# EAGLE schematic central (EAGLE 9.2.1)
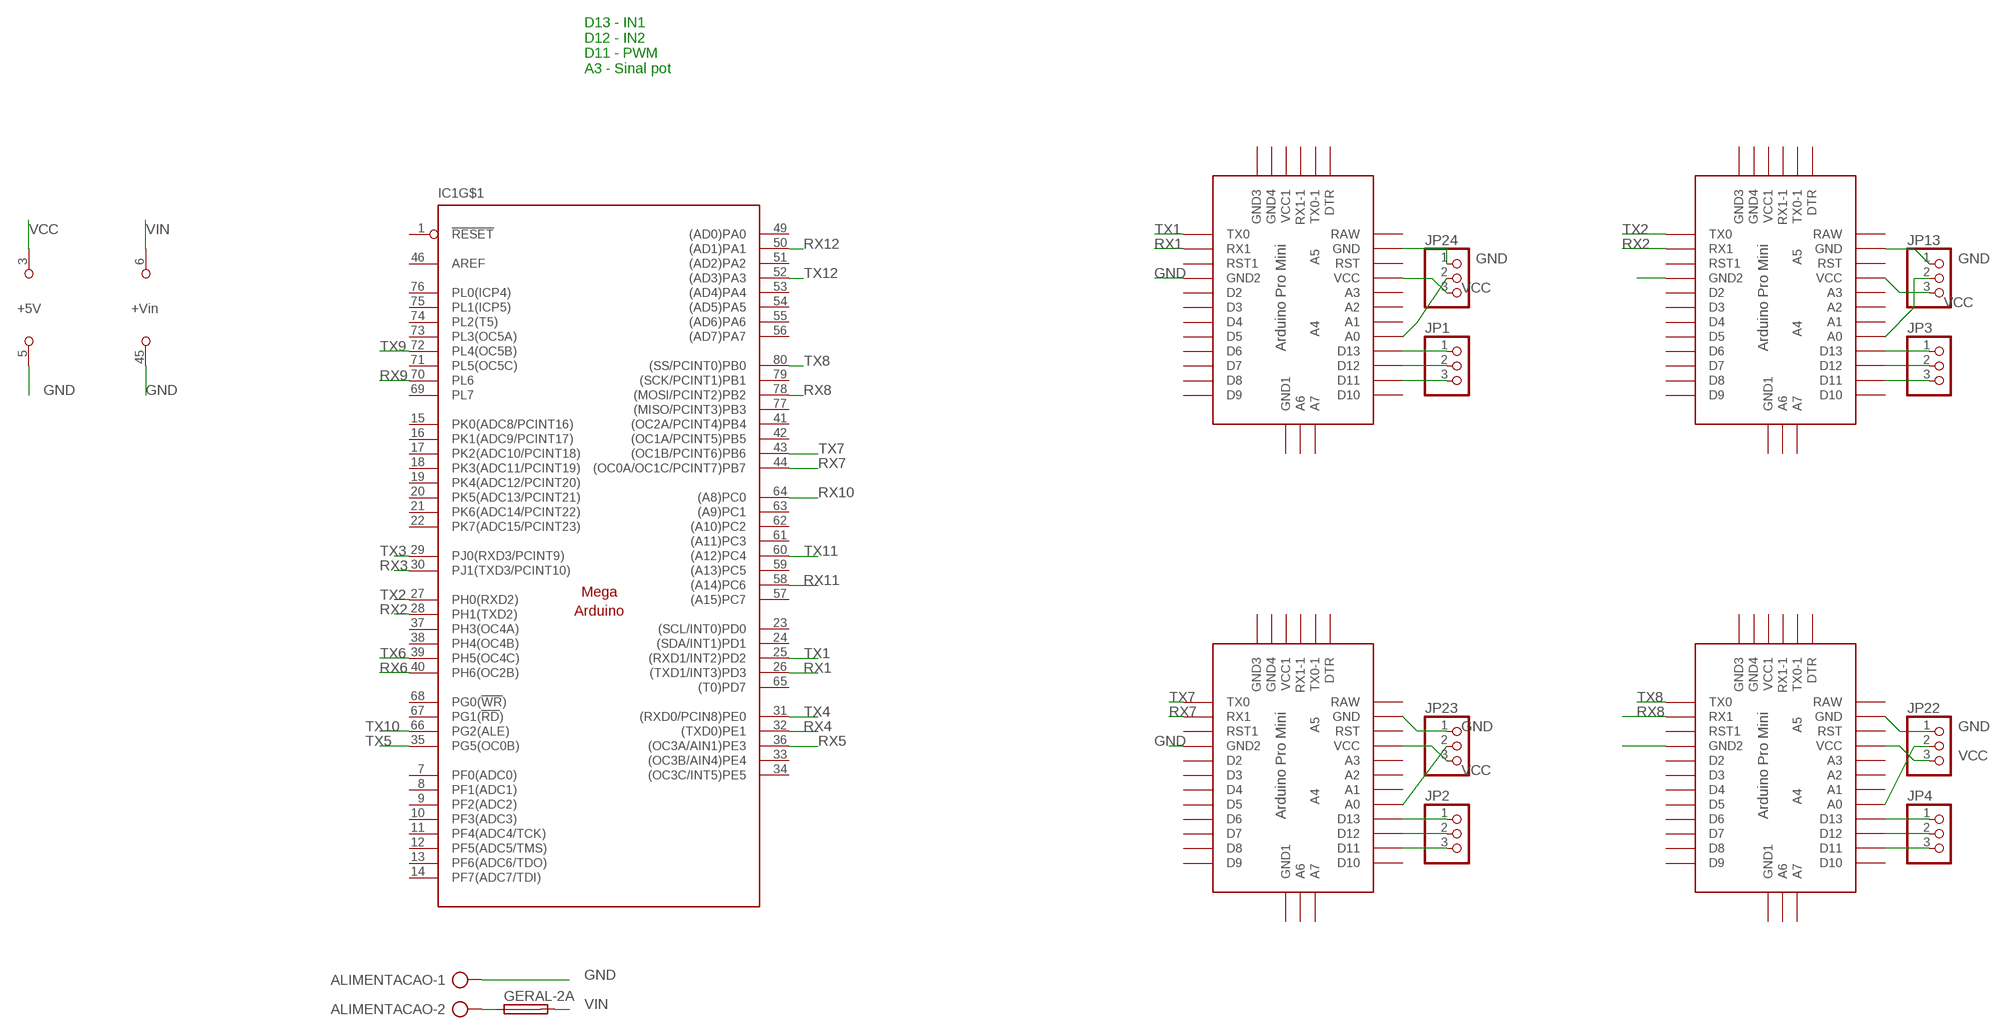
[diagram p0: schematic, sheet 1, part 1 of 2]
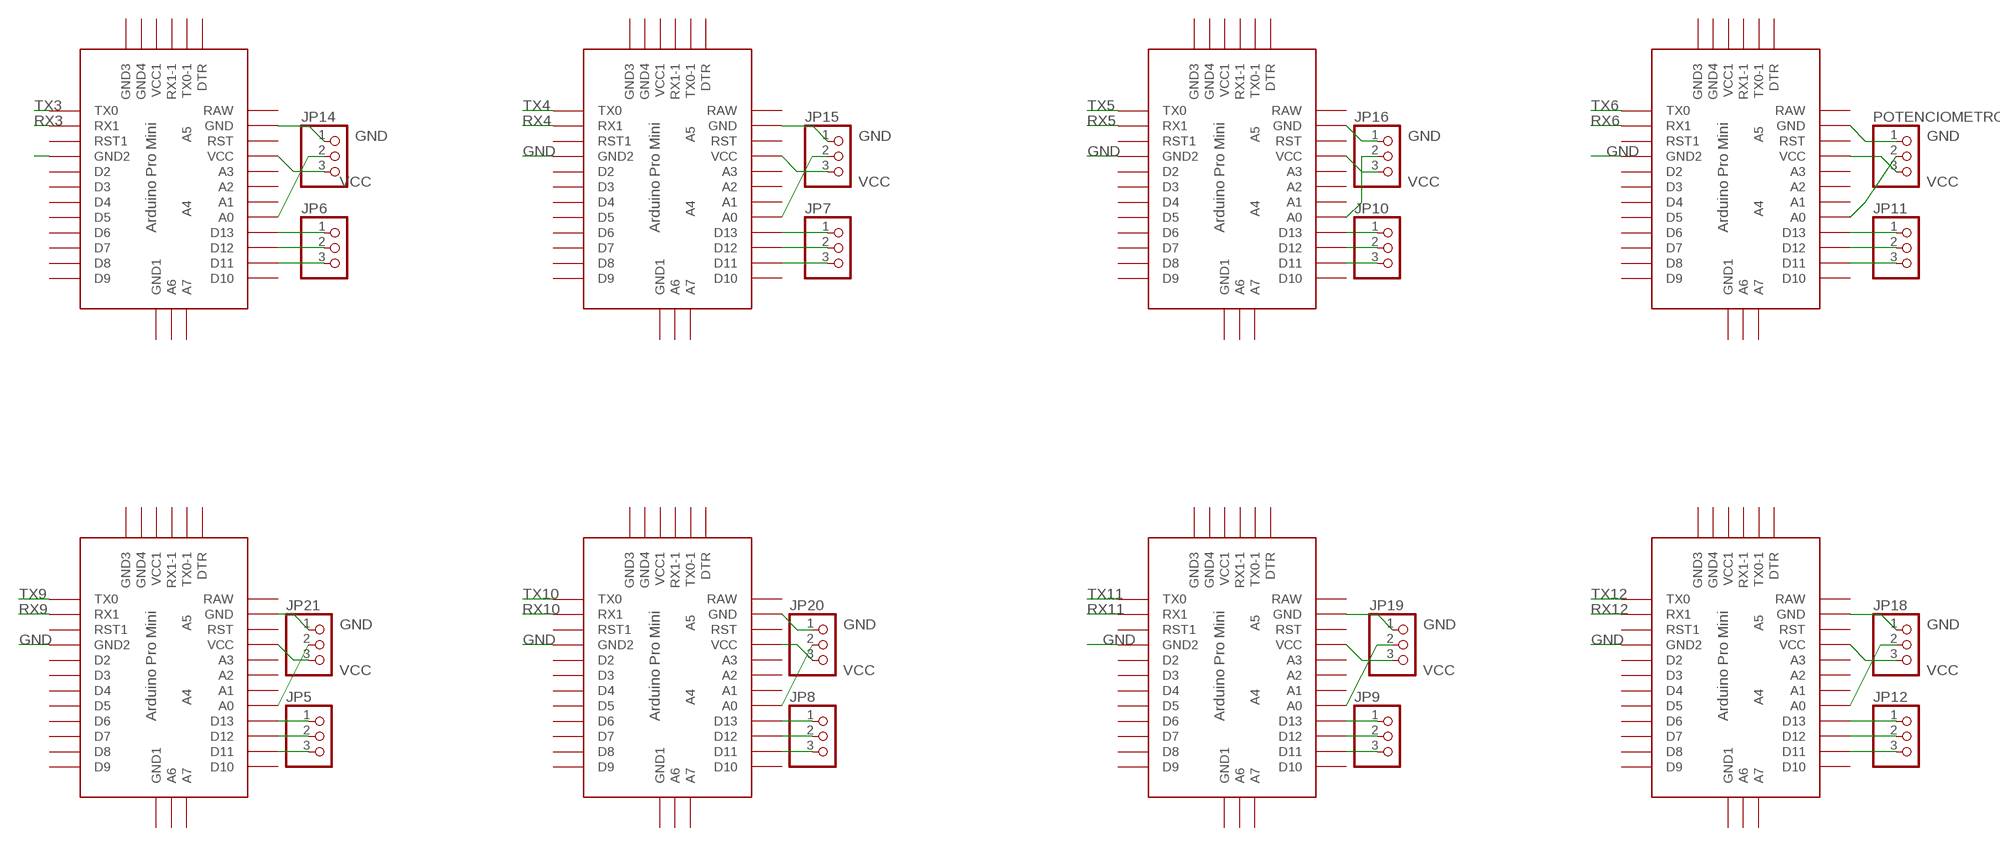
[diagram p1: schematic, sheet 1, part 2 of 2]

## Parts
ALIMENTACAO  AK500/2  [AK500/2]
GERAL-2A  SH22,5A  [SH22,5A]
IC1  MEGAARDUINO_22  [MEGA_ARDUINO_2]
JP1  PINHD-1X3  [1X03]
JP2  PINHD-1X3  [1X03]
JP3  PINHD-1X3  [1X03]
JP4  PINHD-1X3  [1X03]
JP5  PINHD-1X3  [1X03]
JP6  PINHD-1X3  [1X03]
JP7  PINHD-1X3  [1X03]
JP8  PINHD-1X3  [1X03]
JP9  PINHD-1X3  [1X03]
JP10  PINHD-1X3  [1X03]
JP11  PINHD-1X3  [1X03]
JP12  PINHD-1X3  [1X03]
JP13  PINHD-1X3  [1X03]
JP14  PINHD-1X3  [1X03]
JP15  PINHD-1X3  [1X03]
JP16  PINHD-1X3  [1X03]
JP18  PINHD-1X3  [1X03]
JP19  PINHD-1X3  [1X03]
JP20  PINHD-1X3  [1X03]
JP21  PINHD-1X3  [1X03]
JP22  PINHD-1X3  [1X03]
JP23  PINHD-1X3  [1X03]
JP24  PINHD-1X3  [1X03]
POTENCIOMETRO  PINHD-1X3  [1X03]
U$1  ABK-PRO-MINI  [ABK-PRO-MINI]
U$2  ABK-PRO-MINI  [ABK-PRO-MINI]
U$3  ABK-PRO-MINI  [ABK-PRO-MINI]
U$4  ABK-PRO-MINI  [ABK-PRO-MINI]
U$5  ABK-PRO-MINI  [ABK-PRO-MINI]
U$6  ABK-PRO-MINI  [ABK-PRO-MINI]
U$7  ABK-PRO-MINI  [ABK-PRO-MINI]
U$8  ABK-PRO-MINI  [ABK-PRO-MINI]
U$9  ABK-PRO-MINI  [ABK-PRO-MINI]
U$10  ABK-PRO-MINI  [ABK-PRO-MINI]
U$11  ABK-PRO-MINI  [ABK-PRO-MINI]
U$12  ABK-PRO-MINI  [ABK-PRO-MINI]

## Nets
GND: ALIMENTACAO.1 IC1.5(GND) IC1.45(GND) JP13.1 JP14.1 JP15.1 JP16.1 JP18.1 JP19.1 JP20.1 JP21.1 JP22.1 JP23.1 JP24.1 POTENCIOMETRO.1 U$1.GND U$1.GND1(GND2) U$2.GND U$2.GND1(GND2) U$3.GND U$3.GND1(GND2) U$4.GND U$4.GND1(GND2) U$5.GND U$5.GND1(GND2) U$6.GND U$6.GND1(GND2) U$7.GND U$7.GND1(GND2) U$8.GND U$8.GND1(GND2) U$9.GND U$9.GND1(GND2) U$10.GND U$10.GND1(GND2) U$11.GND U$11.GND1(GND2) U$12.GND U$12.GND1(GND2)
N$1: JP1.1 U$1.D13
N$2: JP1.2 U$1.D12
N$3: JP1.3 U$1.D11
N$4: JP3.1 U$7.D13
N$5: JP3.2 U$7.D12
N$6: JP3.3 U$7.D11
N$7: JP6.1 U$3.D13
N$8: JP6.2 U$3.D12
N$9: JP6.3 U$3.D11
N$10: JP7.1 U$5.D13
N$11: JP7.2 U$5.D12
N$12: JP7.3 U$5.D11
N$13: JP10.1 U$9.D13
N$14: JP10.2 U$9.D12
N$15: JP10.3 U$9.D11
N$16: JP11.1 U$11.D13
N$17: JP11.2 U$11.D12
N$18: JP11.3 U$11.D11
N$19: JP12.1 U$12.D13
N$20: JP12.2 U$12.D12
N$21: JP12.3 U$12.D11
N$22: JP9.1 U$10.D13
N$23: JP9.2 U$10.D12
N$24: JP9.3 U$10.D11
N$25: JP8.1 U$6.D13
N$26: JP8.2 U$6.D12
N$27: JP8.3 U$6.D11
N$28: JP5.1 U$4.D13
N$29: JP5.2 U$4.D12
N$30: JP5.3 U$4.D11
N$31: JP4.1 U$8.D13
N$32: JP4.2 U$8.D12
N$33: JP4.3 U$8.D11
N$34: JP2.1 U$2.D13
N$35: JP2.2 U$2.D12
N$36: JP2.3 U$2.D11
N$37: JP13.2 U$7.A0
N$38: JP24.2 U$1.A0
N$39: JP14.2 U$3.A0
N$40: JP15.2 U$5.A0
N$41: JP16.2 U$9.A0
N$42: POTENCIOMETRO.2 U$11.A0
N$43: JP18.2 U$12.A0
N$44: JP19.2 U$10.A0
N$45: JP20.2 U$6.A0
N$46: JP21.2 U$4.A0
N$47: JP22.2 U$8.A0
N$48: JP23.2 U$2.A0
N$62: ALIMENTACAO.2 GERAL-2A.1
RX1: IC1.26((TXD1/INT3)PD3) U$1.RX1
RX2: IC1.28(PH1(TXD2)) U$7.RX1
RX3: IC1.30(PJ1(TXD3/PCINT10)) U$3.RX1
RX4: IC1.32((TXD0)PE1) U$5.RX1
RX5: IC1.36((OC3A/AIN1)PE3) U$9.RX1
RX6: IC1.40(PH6(OC2B)) U$11.RX1
RX7: IC1.44((OC0A/OC1C/PCINT7)PB7) U$2.RX1
RX8: IC1.78((MOSI/PCINT2)PB2) U$8.RX1
RX9: IC1.70(PL6) U$4.RX1
RX10: IC1.64((A8)PC0) U$6.RX1
RX11: IC1.58((A14)PC6) U$10.RX1
RX12: IC1.50((AD1)PA1) U$12.RX1
TX1: IC1.25((RXD1/INT2)PD2) U$1.TX0
TX2: IC1.27(PH0(RXD2)) U$7.TX0
TX3: IC1.29(PJ0(RXD3/PCINT9)) U$3.TX0
TX4: IC1.31((RXD0/PCIN8)PE0) U$5.TX0
TX5: IC1.35(PG5(OC0B)) U$9.TX0
TX6: IC1.39(PH5(OC4C)) U$11.TX0
TX7: IC1.43((OC1B/PCINT6)PB6) U$2.TX0
TX8: IC1.80((SS/PCINT0)PB0) U$8.TX0
TX9: IC1.72(PL4(OC5B)) U$4.TX0
TX10: IC1.66(PG2(ALE)) U$6.TX0
TX11: IC1.60((A12)PC4) U$10.TX0
TX12: IC1.52((AD3)PA3) U$12.TX0
VCC: IC1.3(+5V) JP13.3 JP14.3 JP15.3 JP16.3 JP18.3 JP19.3 JP20.3 JP21.3 JP22.3 JP23.3 JP24.3 POTENCIOMETRO.3 U$1.VCC U$2.VCC U$3.VCC U$4.VCC U$5.VCC U$6.VCC U$7.VCC U$8.VCC U$9.VCC U$10.VCC U$11.VCC U$12.VCC
VIN: GERAL-2A.2 IC1.6(+VIN)
Unconnected: IC1.1(!RESET) IC1.7(PF0(ADC0)) IC1.8(PF1(ADC1)) IC1.9(PF2(ADC2)) IC1.10(PF3(ADC3)) IC1.11(PF4(ADC4/TCK)) IC1.12(PF5(ADC5/TMS)) IC1.13(PF6(ADC6/TDO)) IC1.14(PF7(ADC7/TDI)) IC1.15(PK0(ADC8/PCINT16)) IC1.16(PK1(ADC9/PCINT17)) IC1.17(PK2(ADC10/PCINT18)) IC1.18(PK3(ADC11/PCINT19)) IC1.19(PK4(ADC12/PCINT20)) IC1.20(PK5(ADC13/PCINT21)) IC1.21(PK6(ADC14/PCINT22)) IC1.22(PK7(ADC15/PCINT23)) IC1.23((SCL/INT0)PD0) IC1.24((SDA/INT1)PD1) IC1.33((OC3B/AIN4)PE4) IC1.34((OC3C/INT5)PE5) IC1.37(PH3(OC4A)) IC1.38(PH4(OC4B)) IC1.41((OC2A/PCINT4)PB4) IC1.42((OC1A/PCINT5)PB5) IC1.46(AREF) IC1.49((AD0)PA0) IC1.51((AD2)PA2) IC1.53((AD4)PA4) IC1.54((AD5)PA5) IC1.55((AD6)PA6) IC1.56((AD7)PA7) IC1.57((A15)PC7) IC1.59((A13)PC5) IC1.61((A11)PC3) IC1.62((A10)PC2) IC1.63((A9)PC1) IC1.65((T0)PD7) IC1.67(PG1(!RD!)) IC1.68(PG0(!WR!)) IC1.69(PL7) IC1.71(PL5(OC5C)) IC1.73(PL3(OC5A)) IC1.74(PL2(T5)) IC1.75(PL1(ICP5)) IC1.76(PL0(ICP4)) IC1.77((MISO/PCINT3)PB3) IC1.79((SCK/PCINT1)PB1) U$1.A1 U$1.A2 U$1.A3 U$1.A4 U$1.A5 U$1.A6 U$1.A7 U$1.D2 U$1.D3 U$1.D4 U$1.D5 U$1.D6 U$1.D7 U$1.D8 U$1.D9 U$1.D10 U$1.DTR U$1.GND2(GND3) U$1.GND3(GND4) U$1.GND4(GND1) U$1.RAW U$1.RST U$1.RST1 U$1.RX1-1 U$1.TX0-1 U$1.VCC1 U$2.A1 U$2.A2 U$2.A3 U$2.A4 U$2.A5 U$2.A6 U$2.A7 U$2.D2 U$2.D3 U$2.D4 U$2.D5 U$2.D6 U$2.D7 U$2.D8 U$2.D9 U$2.D10 U$2.DTR U$2.GND2(GND3) U$2.GND3(GND4) U$2.GND4(GND1) U$2.RAW U$2.RST U$2.RST1 U$2.RX1-1 U$2.TX0-1 U$2.VCC1 U$3.A1 U$3.A2 U$3.A3 U$3.A4 U$3.A5 U$3.A6 U$3.A7 U$3.D2 U$3.D3 U$3.D4 U$3.D5 U$3.D6 U$3.D7 U$3.D8 U$3.D9 U$3.D10 U$3.DTR U$3.GND2(GND3) U$3.GND3(GND4) U$3.GND4(GND1) U$3.RAW U$3.RST U$3.RST1 U$3.RX1-1 U$3.TX0-1 U$3.VCC1 U$4.A1 U$4.A2 U$4.A3 U$4.A4 U$4.A5 U$4.A6 U$4.A7 U$4.D2 U$4.D3 U$4.D4 U$4.D5 U$4.D6 U$4.D7 U$4.D8 U$4.D9 U$4.D10 U$4.DTR U$4.GND2(GND3) U$4.GND3(GND4) U$4.GND4(GND1) U$4.RAW U$4.RST U$4.RST1 U$4.RX1-1 U$4.TX0-1 U$4.VCC1 U$5.A1 U$5.A2 U$5.A3 U$5.A4 U$5.A5 U$5.A6 U$5.A7 U$5.D2 U$5.D3 U$5.D4 U$5.D5 U$5.D6 U$5.D7 U$5.D8 U$5.D9 U$5.D10 U$5.DTR U$5.GND2(GND3) U$5.GND3(GND4) U$5.GND4(GND1) U$5.RAW U$5.RST U$5.RST1 U$5.RX1-1 U$5.TX0-1 U$5.VCC1 U$6.A1 U$6.A2 U$6.A3 U$6.A4 U$6.A5 U$6.A6 U$6.A7 U$6.D2 U$6.D3 U$6.D4 U$6.D5 U$6.D6 U$6.D7 U$6.D8 U$6.D9 U$6.D10 U$6.DTR U$6.GND2(GND3) U$6.GND3(GND4) U$6.GND4(GND1) U$6.RAW U$6.RST U$6.RST1 U$6.RX1-1 U$6.TX0-1 U$6.VCC1 U$7.A1 U$7.A2 U$7.A3 U$7.A4 U$7.A5 U$7.A6 U$7.A7 U$7.D2 U$7.D3 U$7.D4 U$7.D5 U$7.D6 U$7.D7 U$7.D8 U$7.D9 U$7.D10 U$7.DTR U$7.GND2(GND3) U$7.GND3(GND4) U$7.GND4(GND1) U$7.RAW U$7.RST U$7.RST1 U$7.RX1-1 U$7.TX0-1 U$7.VCC1 U$8.A1 U$8.A2 U$8.A3 U$8.A4 U$8.A5 U$8.A6 U$8.A7 U$8.D2 U$8.D3 U$8.D4 U$8.D5 U$8.D6 U$8.D7 U$8.D8 U$8.D9 U$8.D10 U$8.DTR U$8.GND2(GND3) U$8.GND3(GND4) U$8.GND4(GND1) U$8.RAW U$8.RST U$8.RST1 U$8.RX1-1 U$8.TX0-1 U$8.VCC1 U$9.A1 U$9.A2 U$9.A3 U$9.A4 U$9.A5 U$9.A6 U$9.A7 U$9.D2 U$9.D3 U$9.D4 U$9.D5 U$9.D6 U$9.D7 U$9.D8 U$9.D9 U$9.D10 U$9.DTR U$9.GND2(GND3) U$9.GND3(GND4) U$9.GND4(GND1) U$9.RAW U$9.RST U$9.RST1 U$9.RX1-1 U$9.TX0-1 U$9.VCC1 U$10.A1 U$10.A2 U$10.A3 U$10.A4 U$10.A5 U$10.A6 U$10.A7 U$10.D2 U$10.D3 U$10.D4 U$10.D5 U$10.D6 U$10.D7 U$10.D8 U$10.D9 U$10.D10 U$10.DTR U$10.GND2(GND3) U$10.GND3(GND4) U$10.GND4(GND1) U$10.RAW U$10.RST U$10.RST1 U$10.RX1-1 U$10.TX0-1 U$10.VCC1 U$11.A1 U$11.A2 U$11.A3 U$11.A4 U$11.A5 U$11.A6 U$11.A7 U$11.D2 U$11.D3 U$11.D4 U$11.D5 U$11.D6 U$11.D7 U$11.D8 U$11.D9 U$11.D10 U$11.DTR U$11.GND2(GND3) U$11.GND3(GND4) U$11.GND4(GND1) U$11.RAW U$11.RST U$11.RST1 U$11.RX1-1 U$11.TX0-1 U$11.VCC1 U$12.A1 U$12.A2 U$12.A3 U$12.A4 U$12.A5 U$12.A6 U$12.A7 U$12.D2 U$12.D3 U$12.D4 U$12.D5 U$12.D6 U$12.D7 U$12.D8 U$12.D9 U$12.D10 U$12.DTR U$12.GND2(GND3) U$12.GND3(GND4) U$12.GND4(GND1) U$12.RAW U$12.RST U$12.RST1 U$12.RX1-1 U$12.TX0-1 U$12.VCC1

## Notes on the sheet
- D13 - IN1
  D12 - IN2
  D11 - PWM
  A3 - Sinal pot

## Power pins joined to a net without a drawn wire
+3V3: IC1.2(+3V3)
+5V: IC1.47(+5V) IC1.48(+5V)
GND: IC1.4(GND) IC1.81(GND) IC1.82(GND)

## Library data of the parts
ALIMENTACAO = con-ptr500:AK500/2: CONNECTOR; OC_FARNELL: unknown; OC_NEWARK: unknown
GERAL-2A = fuse:SH22,5A: FUSE HOLDER grid 22,5mm, isolated cap OGN0031 8201, Schurter (Buerklin); MPN: 0031.7701.11; OC_FARNELL: unknown; OC_NEWARK: 04F1224
IC1 = arduino:MEGAARDUINO_2: The Arduino Mega is a microcontroller board based on the ATmega1280. - 54 digital input/output pins (of which 14 can be used as PWM outputs) - 16 analog inputs - 4 UARTs (hardware serial ports) - 16 MHz crystal oscillator - USB connection - power jack - ICSP header - reset button It contains everything needed to support the microcontroller; simply connect it to a computer with a USB cable or power it with a AC-to-DC adapter or battery to get started. The Mega is compatible with most shields designed for the Arduino Duemilanove or Diecimila. http://arduino.cc/en/Main/ArduinoBoardMega
JP1-JP16 JP18-JP24 POTENCIOMETRO = pinhead:PINHD-1X3: PIN HEADER
U$1-U$12 = arduino1:ABK-PRO-MINI: ABK Pro-Mini Arduino Clone